# Altium project 2008_SablierElectronique.PrjPcb
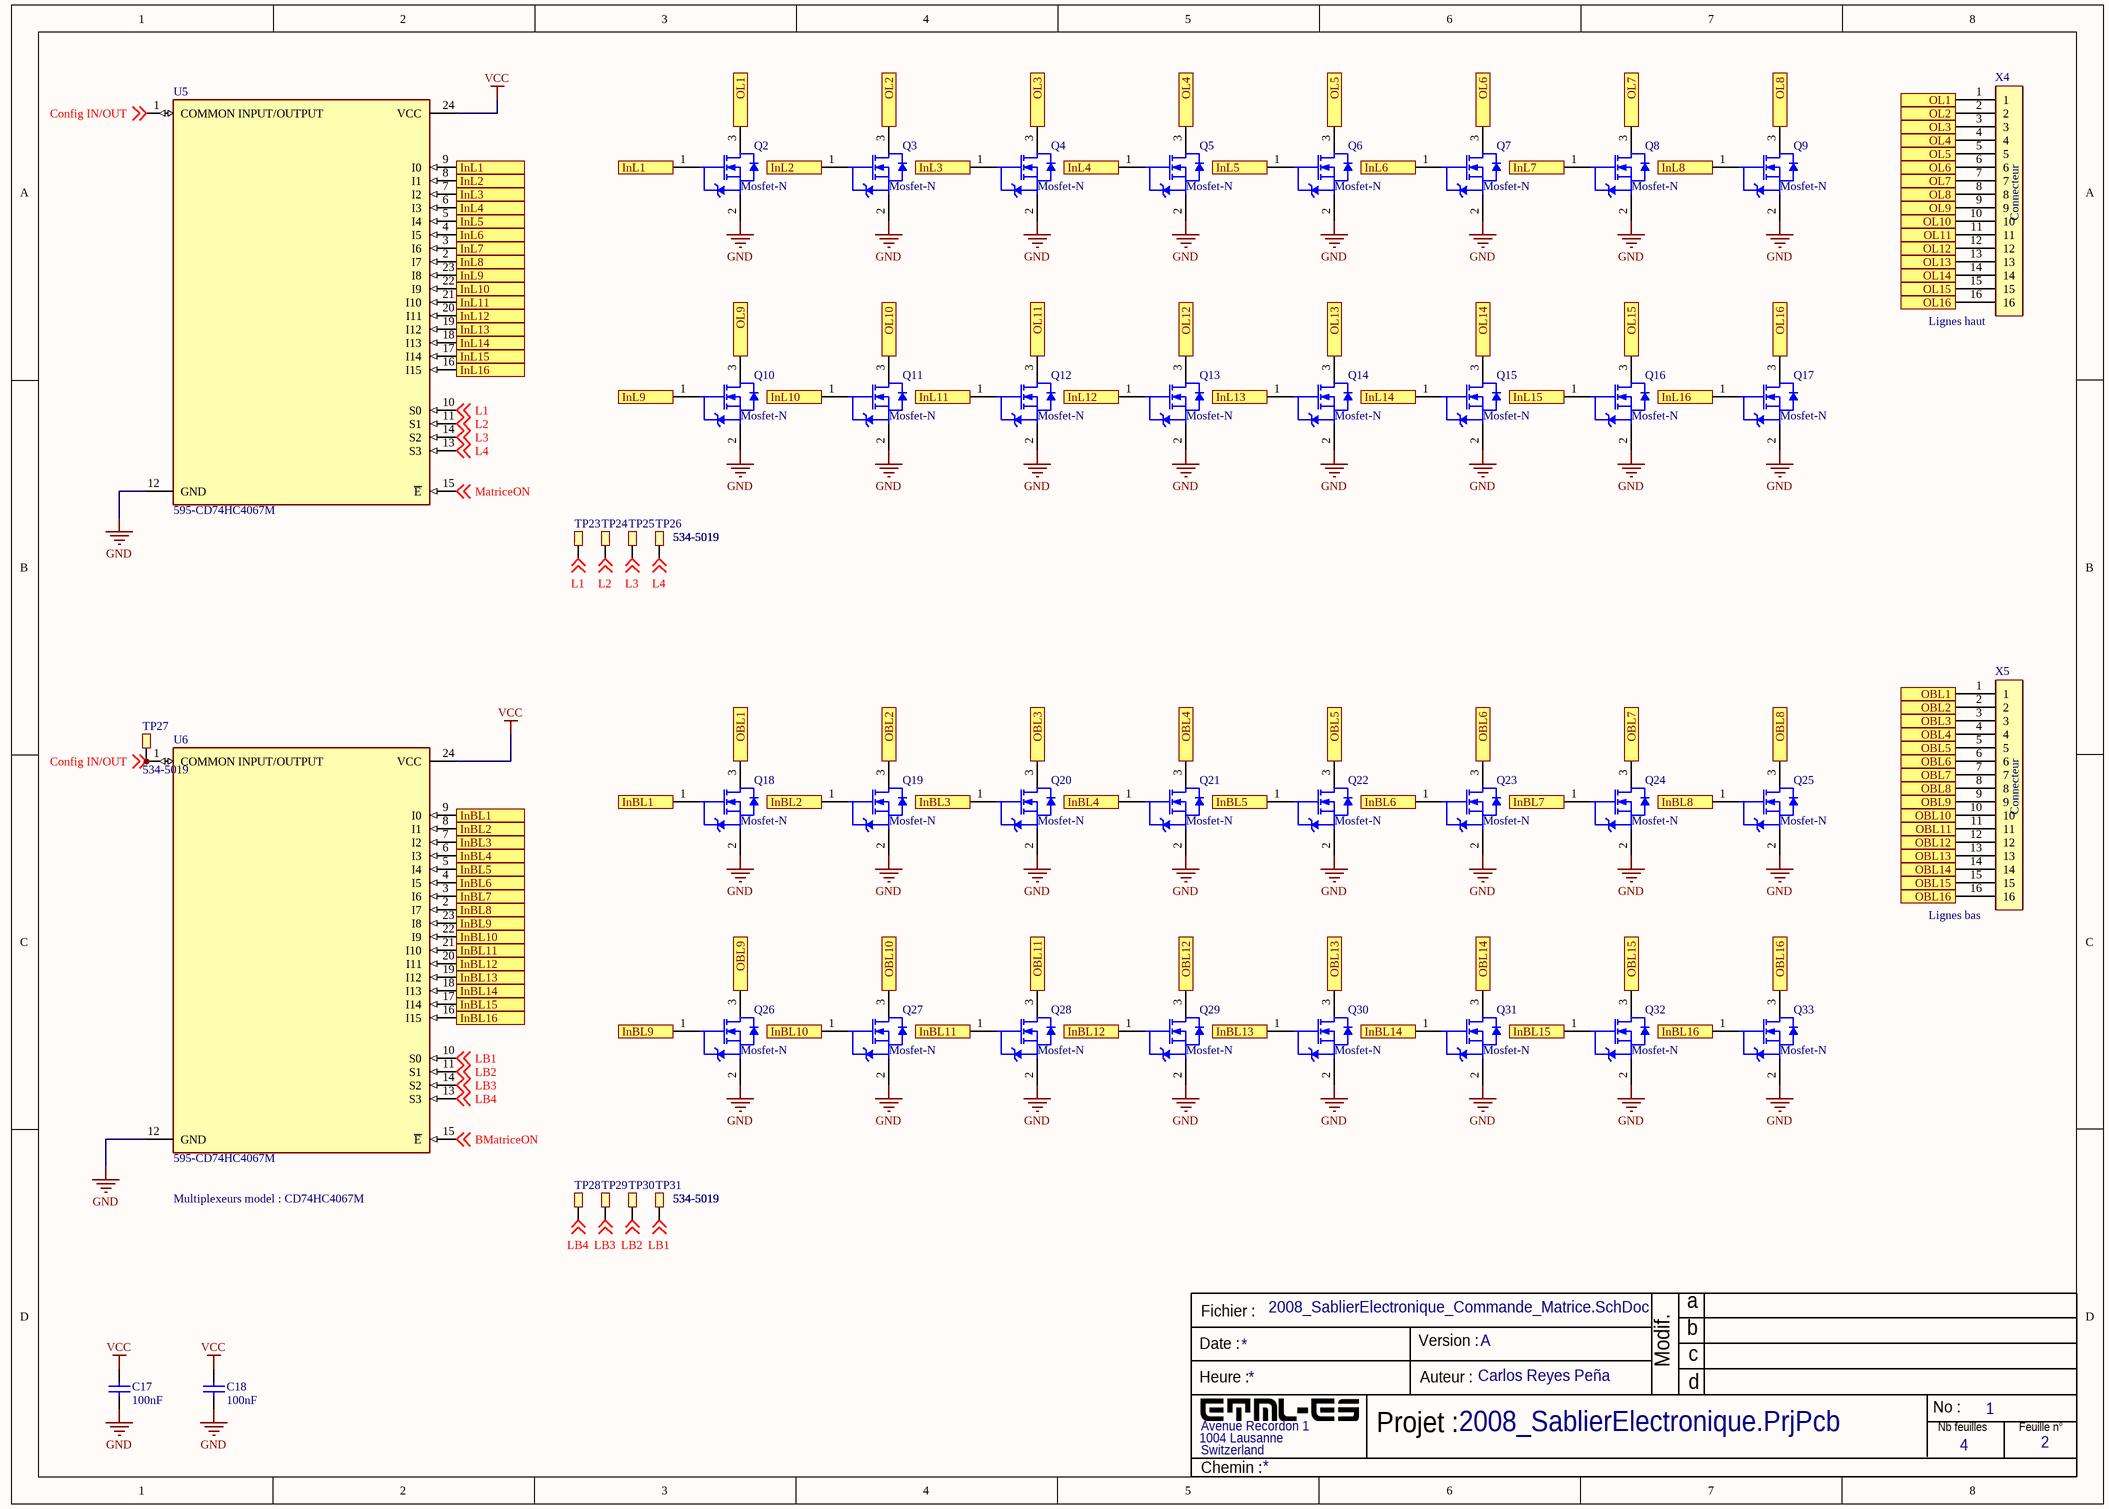
[diagram p0: 2008_SablierElectronique_Commande_Matrice.SchDoc]
3 sheets, 173 parts. Net scope: flat (ports and power ports of the same name join across sheets).
Board file: 2008_SablierElectronique_PCB.PcbDoc
Sheets:
  2008_SablierElectronique_Commande_Matrice.SchDoc
  2008_SablierElectronique_MosfetConnections.SchDoc
  2008_SablierElectronique_SCH.SchDoc

## Sheet 2008_SablierElectronique_Commande_Matrice.SchDoc
size A3; Author: Carlos Reyes Peña; Organization: ETML-ES; Address1: Avenue Recordon 1; Address2: 1004 Lausanne; Address3: Switzerland; Revision: 1; SheetNumber: 2; SheetTotal: 4; Version: A

### Parts
C17  100nF  [RESC0805(2012)_L]
C18  100nF  [RESC0805(2012)_L]
Q2  Mosfet-N  [FAIR-SOT23-3_V]
Q3  Mosfet-N  [FAIR-SOT23-3_V]
Q4  Mosfet-N  [FAIR-SOT23-3_V]
Q5  Mosfet-N  [FAIR-SOT23-3_V]
Q6  Mosfet-N  [FAIR-SOT23-3_V]
Q7  Mosfet-N  [FAIR-SOT23-3_V]
Q8  Mosfet-N  [FAIR-SOT23-3_V]
Q9  Mosfet-N  [FAIR-SOT23-3_V]
Q10  Mosfet-N  [FAIR-SOT23-3_V]
Q11  Mosfet-N  [FAIR-SOT23-3_V]
Q12  Mosfet-N  [FAIR-SOT23-3_V]
Q13  Mosfet-N  [FAIR-SOT23-3_V]
Q14  Mosfet-N  [FAIR-SOT23-3_V]
Q15  Mosfet-N  [FAIR-SOT23-3_V]
Q16  Mosfet-N  [FAIR-SOT23-3_V]
Q17  Mosfet-N  [FAIR-SOT23-3_V]
Q18  Mosfet-N  [FAIR-SOT23-3_V]
Q19  Mosfet-N  [FAIR-SOT23-3_V]
Q20  Mosfet-N  [FAIR-SOT23-3_V]
Q21  Mosfet-N  [FAIR-SOT23-3_V]
Q22  Mosfet-N  [FAIR-SOT23-3_V]
Q23  Mosfet-N  [FAIR-SOT23-3_V]
Q24  Mosfet-N  [FAIR-SOT23-3_V]
Q25  Mosfet-N  [FAIR-SOT23-3_V]
Q26  Mosfet-N  [FAIR-SOT23-3_V]
Q27  Mosfet-N  [FAIR-SOT23-3_V]
Q28  Mosfet-N  [FAIR-SOT23-3_V]
Q29  Mosfet-N  [FAIR-SOT23-3_V]
Q30  Mosfet-N  [FAIR-SOT23-3_V]
Q31  Mosfet-N  [FAIR-SOT23-3_V]
Q32  Mosfet-N  [FAIR-SOT23-3_V]
Q33  Mosfet-N  [FAIR-SOT23-3_V]
TP23  Supplier Part Number 1: 534-5019  [TESTPOINT_SMD]  (hidden comment: 5019)
TP24  Supplier Part Number 1: 534-5019  [TESTPOINT_SMD]  (hidden comment: 5019)
TP25  Supplier Part Number 1: 534-5019  [TESTPOINT_SMD]  (hidden comment: 5019)
TP26  Supplier Part Number 1: 534-5019  [TESTPOINT_SMD]  (hidden comment: 5019)
TP27  Supplier Part Number 1: 534-5019  [TESTPOINT_SMD]  (hidden comment: 5019)
TP28  Supplier Part Number 1: 534-5019  [TESTPOINT_SMD]  (hidden comment: 5019)
TP29  Supplier Part Number 1: 534-5019  [TESTPOINT_SMD]  (hidden comment: 5019)
TP30  Supplier Part Number 1: 534-5019  [TESTPOINT_SMD]  (hidden comment: 5019)
TP31  Supplier Part Number 1: 534-5019  [TESTPOINT_SMD]  (hidden comment: 5019)
U5  Supplier Part Number 1: 595-CD74HC4067M  [SOIC24]  (hidden comment: CD74HCT4067)
U6  Supplier Part Number 1: 595-CD74HC4067M  [SOIC24]  (hidden comment: CD74HCT4067)
X4  Lignes haut  [CON8x8(edited)]
X5  Lignes bas  [CON8x8(edited)]

### Ports
InBL1 (in), InBL1 (out), InBL2 (in), InBL2 (out), InBL3 (in), InBL3 (out), InBL4 (in), InBL4 (out), InBL5 (in), InBL5 (out), InBL6 (in), InBL6 (out), InBL7 (in), InBL7 (out), InBL8 (in), InBL8 (out), InBL9 (in), InBL9 (out), InBL10 (in), InBL10 (out), InBL11 (in), InBL11 (out), InBL12 (in), InBL12 (out), InBL13 (in), InBL13 (out), InBL14 (in), InBL14 (out), InBL15 (in), InBL15 (out), InBL16 (in), InBL16 (out), InL1 (in), InL1 (out), InL2 (in), InL2 (out), InL3 (in), InL3 (out), InL4 (in), InL4 (out), InL5 (in), InL5 (out), InL6 (in), InL6 (out), InL7 (in), InL7 (out), InL8 (in), InL8 (out), InL9 (in), InL9 (out), InL10 (in), InL10 (out), InL11 (in), InL11 (out), InL12 (in), InL12 (out), InL13 (in), InL13 (out), InL14 (in), InL14 (out), InL15 (in), InL15 (out), InL16 (in), InL16 (out), OBL1 (in), OBL1 (out), OBL2 (in), OBL2 (out), OBL3 (in), OBL3 (out), OBL4 (in), OBL4 (out), OBL5 (in), OBL5 (out), OBL6 (in), OBL6 (out), OBL7 (in), OBL7 (out), OBL8 (in), OBL8 (out), OBL9 (in), OBL9 (out), OBL10 (in), OBL10 (out), OBL11 (in), OBL11 (out), OBL12 (in), OBL12 (out), OBL13 (in), OBL13 (out), OBL14 (in), OBL14 (out), OBL15 (in), OBL15 (out), OBL16 (in), OBL16 (out), OL1 (in), OL1 (out), OL2 (in), OL2 (out), OL3 (in), OL3 (out), OL4 (in), OL4 (out), OL5 (in), OL5 (out), OL6 (in), OL6 (out), OL7 (in), OL7 (out), OL8 (in), OL8 (out), OL9 (in), OL9 (out), OL10 (in), OL10 (out), OL11 (in), OL11 (out), OL12 (in), OL12 (out), OL13 (in), OL13 (out), OL14 (in), OL14 (out), OL15 (in), OL15 (out), OL16 (in), OL16 (out)

### Nets
GND: C17.1 C18.1 Q2.2(S) Q3.2(S) Q4.2(S) Q5.2(S) Q6.2(S) Q7.2(S) Q8.2(S) Q9.2(S) Q10.2(S) Q11.2(S) Q12.2(S) Q13.2(S) Q14.2(S) Q15.2(S) Q16.2(S) Q17.2(S) Q18.2(S) Q19.2(S) Q20.2(S) Q21.2(S) Q22.2(S) Q23.2(S) Q24.2(S) Q25.2(S) Q26.2(S) Q27.2(S) Q28.2(S) Q29.2(S) Q30.2(S) Q31.2(S) Q32.2(S) Q33.2(S) U5.12(GND) U6.12(GND)
VCC: C17.2 C18.2 U5.24(VCC) U6.24(VCC)
BMatriceON: U6.15(~{E}) ; off-sheet BMatriceON
Config IN/OUT: TP27.1 U5.1(COMMON_INPUT/OUTPUT) U6.1(COMMON_INPUT/OUTPUT) ; off-sheet Config IN/OUT
L1: TP23.1 U5.10(S0) ; off-sheet L1
L2: TP24.1 U5.11(S1) ; off-sheet L2
L3: TP25.1 U5.14(S2) ; off-sheet L3
L4: TP26.1 U5.13(S3) ; off-sheet L4
LB1: TP31.1 U6.10(S0) ; off-sheet LB1
LB2: TP30.1 U6.11(S1) ; off-sheet LB2
LB3: TP29.1 U6.14(S2) ; off-sheet LB3
LB4: TP28.1 U6.13(S3) ; off-sheet LB4
MatriceON: U5.15(~{E}) ; off-sheet MatriceON
NetQ2_1: Q2.1(G) U5.9(I0) ; port InL1
NetQ2_3: Q2.3(D) X4.1 ; port OL1
NetQ3_1: Q3.1(G) U5.8(I1) ; port InL2
NetQ3_3: Q3.3(D) X4.2 ; port OL2
NetQ4_1: Q4.1(G) U5.7(I2) ; port InL3
NetQ4_3: Q4.3(D) X4.3 ; port OL3
NetQ5_1: Q5.1(G) U5.6(I3) ; port InL4
NetQ5_3: Q5.3(D) X4.4 ; port OL4
NetQ6_1: Q6.1(G) U5.5(I4) ; port InL5
NetQ6_3: Q6.3(D) X4.5 ; port OL5
NetQ7_1: Q7.1(G) U5.4(I5) ; port InL6
NetQ7_3: Q7.3(D) X4.6 ; port OL6
NetQ8_1: Q8.1(G) U5.3(I6) ; port InL7
NetQ8_3: Q8.3(D) X4.7 ; port OL7
NetQ9_1: Q9.1(G) U5.2(I7) ; port InL8
NetQ9_3: Q9.3(D) X4.8 ; port OL8
NetQ10_1: Q10.1(G) U5.23(I8) ; port InL9
NetQ10_3: Q10.3(D) X4.9 ; port OL9
NetQ11_1: Q11.1(G) U5.22(I9) ; port InL10
NetQ11_3: Q11.3(D) X4.10 ; port OL10
NetQ12_1: Q12.1(G) U5.21(I10) ; port InL11
NetQ12_3: Q12.3(D) X4.11 ; port OL11
NetQ13_1: Q13.1(G) U5.20(I11) ; port InL12
NetQ13_3: Q13.3(D) X4.12 ; port OL12
NetQ14_1: Q14.1(G) U5.19(I12) ; port InL13
NetQ14_3: Q14.3(D) X4.13 ; port OL13
NetQ15_1: Q15.1(G) U5.18(I13) ; port InL14
NetQ15_3: Q15.3(D) X4.14 ; port OL14
NetQ16_1: Q16.1(G) U5.17(I14) ; port InL15
NetQ16_3: Q16.3(D) X4.15 ; port OL15
NetQ17_1: Q17.1(G) U5.16(I15) ; port InL16
NetQ17_3: Q17.3(D) X4.16 ; port OL16
NetQ18_1: Q18.1(G) U6.9(I0) ; port InBL1
NetQ18_3: Q18.3(D) X5.1 ; port OBL1
NetQ19_1: Q19.1(G) U6.8(I1) ; port InBL2
NetQ19_3: Q19.3(D) X5.2 ; port OBL2
NetQ20_1: Q20.1(G) U6.7(I2) ; port InBL3
NetQ20_3: Q20.3(D) X5.3 ; port OBL3
NetQ21_1: Q21.1(G) U6.6(I3) ; port InBL4
NetQ21_3: Q21.3(D) X5.4 ; port OBL4
NetQ22_1: Q22.1(G) U6.5(I4) ; port InBL5
NetQ22_3: Q22.3(D) X5.5 ; port OBL5
NetQ23_1: Q23.1(G) U6.4(I5) ; port InBL6
NetQ23_3: Q23.3(D) X5.6 ; port OBL6
NetQ24_1: Q24.1(G) U6.3(I6) ; port InBL7
NetQ24_3: Q24.3(D) X5.7 ; port OBL7
NetQ25_1: Q25.1(G) U6.2(I7) ; port InBL8
NetQ25_3: Q25.3(D) X5.8 ; port OBL8
NetQ26_1: Q26.1(G) U6.23(I8) ; port InBL9
NetQ26_3: Q26.3(D) X5.9 ; port OBL9
NetQ27_1: Q27.1(G) U6.22(I9) ; port InBL10
NetQ27_3: Q27.3(D) X5.10 ; port OBL10
NetQ28_1: Q28.1(G) U6.21(I10) ; port InBL11
NetQ28_3: Q28.3(D) X5.11 ; port OBL11
NetQ29_1: Q29.1(G) U6.20(I11) ; port InBL12
NetQ29_3: Q29.3(D) X5.12 ; port OBL12
NetQ30_1: Q30.1(G) U6.19(I12) ; port InBL13
NetQ30_3: Q30.3(D) X5.13 ; port OBL13
NetQ31_1: Q31.1(G) U6.18(I13) ; port InBL14
NetQ31_3: Q31.3(D) X5.14 ; port OBL14
NetQ32_1: Q32.1(G) U6.17(I14) ; port InBL15
NetQ32_3: Q32.3(D) X5.15 ; port OBL15
NetQ33_1: Q33.1(G) U6.16(I15) ; port InBL16
NetQ33_3: Q33.3(D) X5.16 ; port OBL16

### Notes on the sheet
- Multiplexeurs model : CD74HC4067M
- Fichier :
- a
- Date :
- Heure :
- Version :
- Auteur :
- Modif.
- b
- c
- d
- Projet :
- No :
- Nb feuilles
- Feuille n°
- Chemin :
- (in symbol Mâle DIN 8 x 8) Connecteur

### Library data of the parts
C17 C18 = CAP1206
Q2-Q33 = NEMOS-GSD-3_D
TP23-TP31 = TESTPOINT: Test point smd; Supplier 1: Mouser
X4 X5 = Mâle DIN 8 x 8
U5 U6 = CD74HCT4067: Supplier 1: Mouser

## Sheet 2008_SablierElectronique_MosfetConnections.SchDoc
size A3; Author: Carlos Reyes Peña; Organization: ETML-ES; Address1: Avenue Recordon 1; Address2: 1004 Lausanne; Address3: Switzerland; Revision: 1; SheetNumber: 3; SheetTotal: 4; Version: A
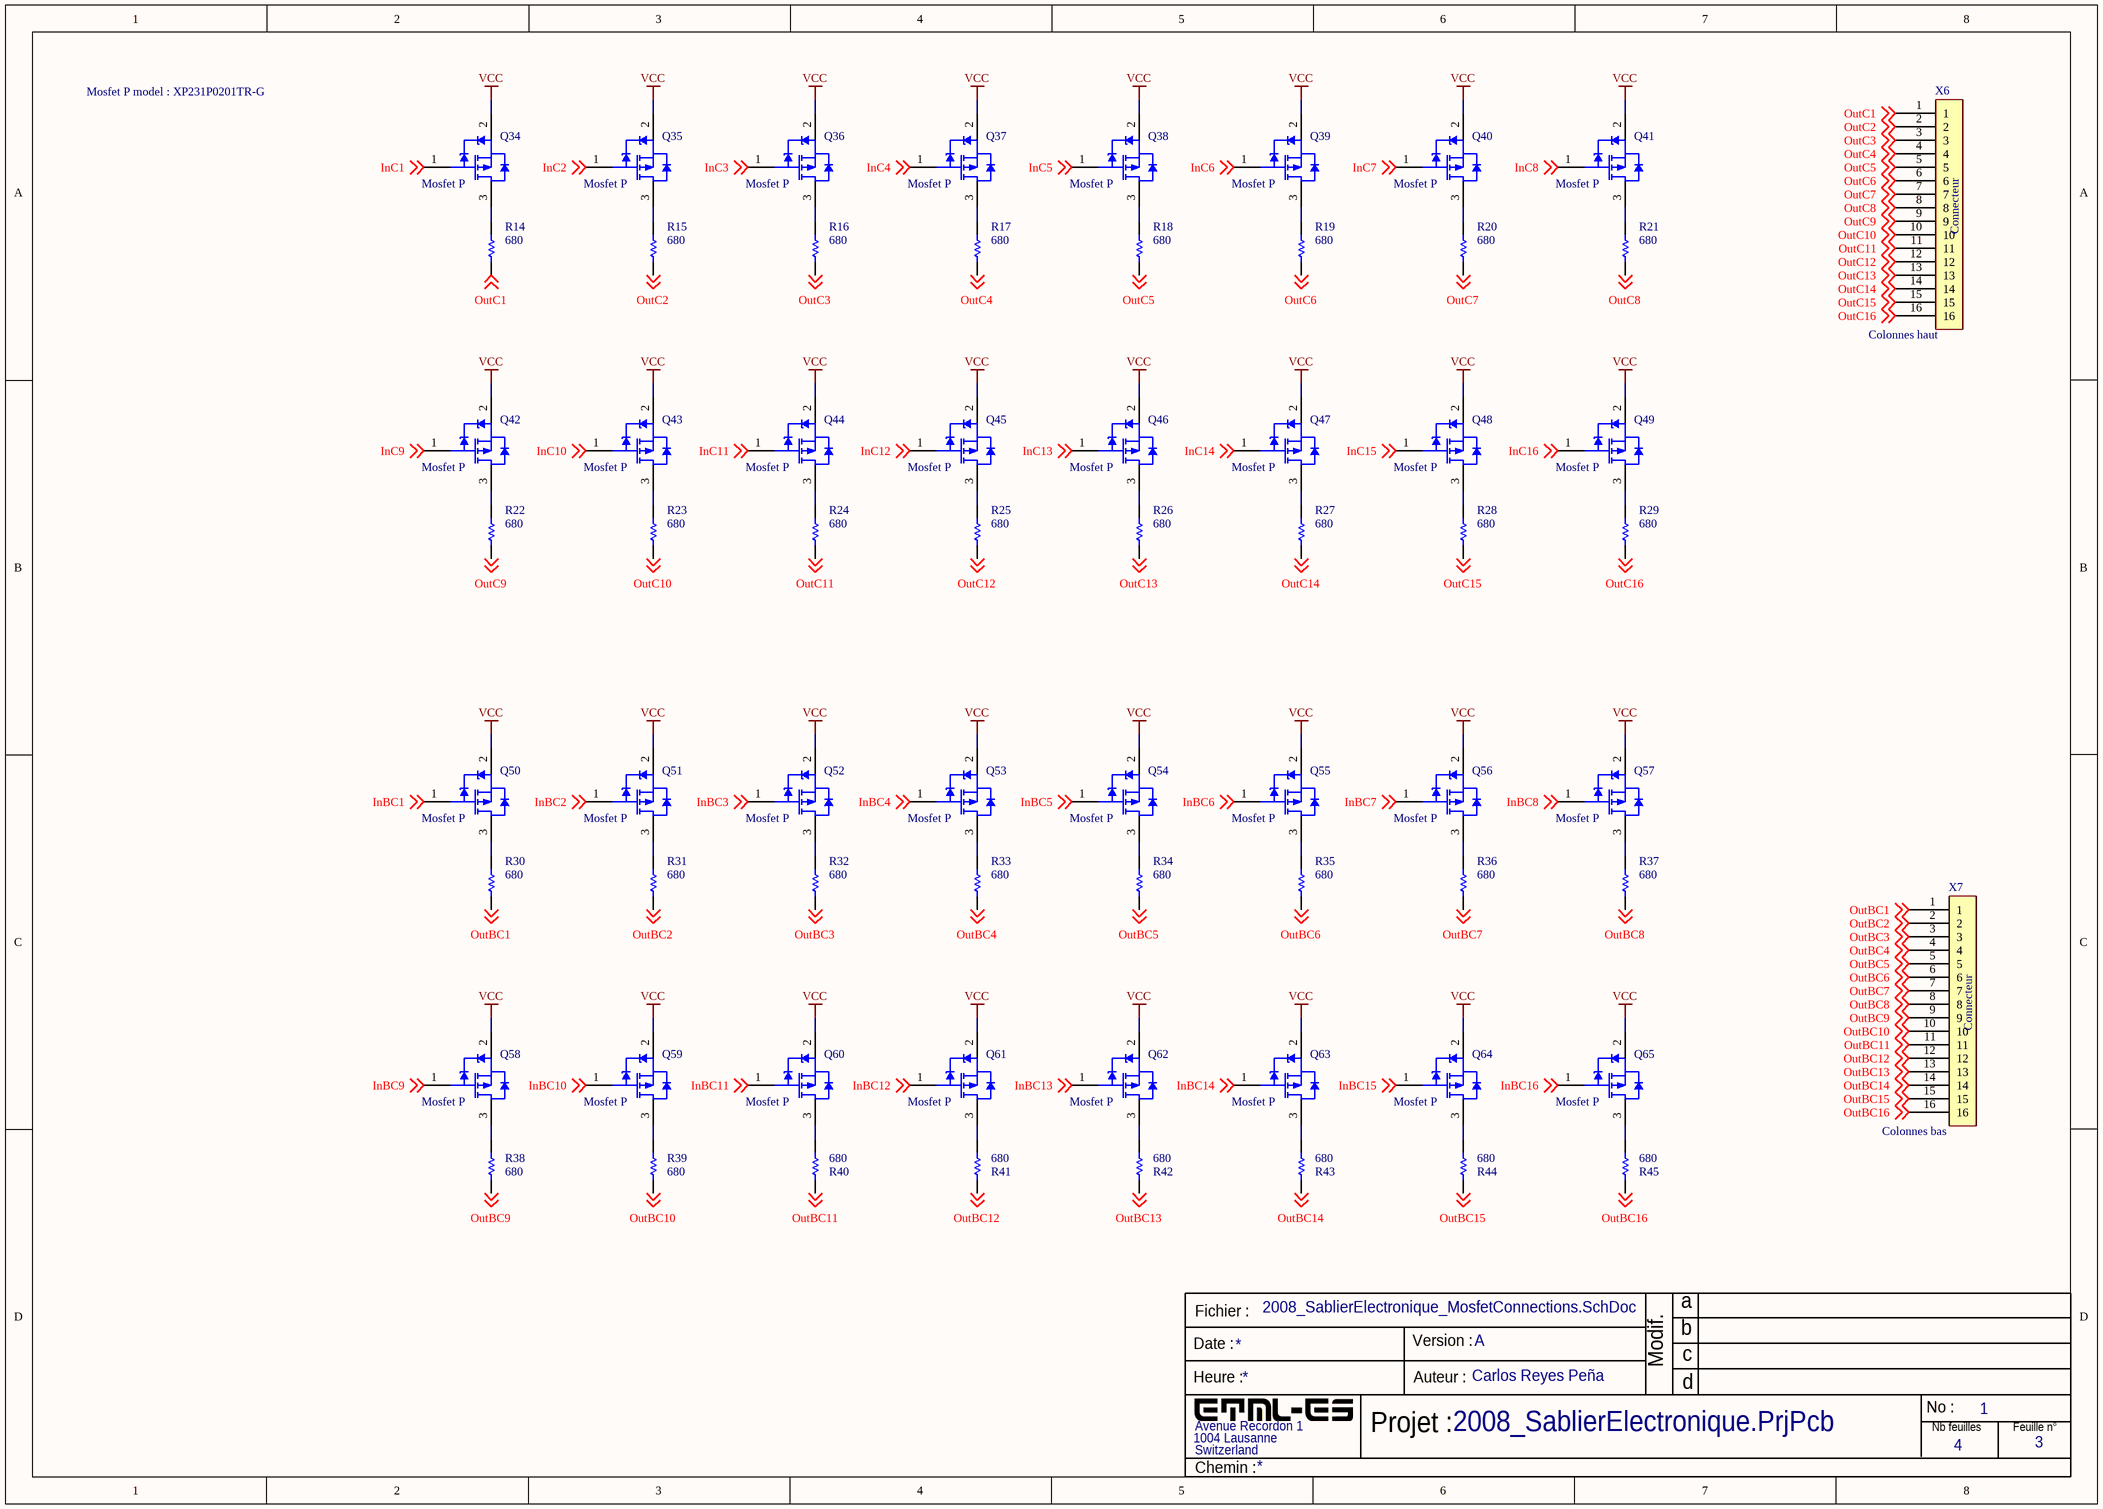
[diagram p1: 2008_SablierElectronique_MosfetConnections.SchDoc]

### Parts
Q34  Mosfet P  [FAIR-SOT23-3_V]
Q35  Mosfet P  [FAIR-SOT23-3_V]
Q36  Mosfet P  [FAIR-SOT23-3_V]
Q37  Mosfet P  [FAIR-SOT23-3_V]
Q38  Mosfet P  [FAIR-SOT23-3_V]
Q39  Mosfet P  [FAIR-SOT23-3_V]
Q40  Mosfet P  [FAIR-SOT23-3_V]
Q41  Mosfet P  [FAIR-SOT23-3_V]
Q42  Mosfet P  [FAIR-SOT23-3_V]
Q43  Mosfet P  [FAIR-SOT23-3_V]
Q44  Mosfet P  [FAIR-SOT23-3_V]
Q45  Mosfet P  [FAIR-SOT23-3_V]
Q46  Mosfet P  [FAIR-SOT23-3_V]
Q47  Mosfet P  [FAIR-SOT23-3_V]
Q48  Mosfet P  [FAIR-SOT23-3_V]
Q49  Mosfet P  [FAIR-SOT23-3_V]
Q50  Mosfet P  [FAIR-SOT23-3_V]
Q51  Mosfet P  [FAIR-SOT23-3_V]
Q52  Mosfet P  [FAIR-SOT23-3_V]
Q53  Mosfet P  [FAIR-SOT23-3_V]
Q54  Mosfet P  [FAIR-SOT23-3_V]
Q55  Mosfet P  [FAIR-SOT23-3_V]
Q56  Mosfet P  [FAIR-SOT23-3_V]
Q57  Mosfet P  [FAIR-SOT23-3_V]
Q58  Mosfet P  [FAIR-SOT23-3_V]
Q59  Mosfet P  [FAIR-SOT23-3_V]
Q60  Mosfet P  [FAIR-SOT23-3_V]
Q61  Mosfet P  [FAIR-SOT23-3_V]
Q62  Mosfet P  [FAIR-SOT23-3_V]
Q63  Mosfet P  [FAIR-SOT23-3_V]
Q64  Mosfet P  [FAIR-SOT23-3_V]
Q65  Mosfet P  [FAIR-SOT23-3_V]
R14  680  [RESC0805(2012)_L]
R15  680  [RESC0805(2012)_L]
R16  680  [RESC0805(2012)_L]
R17  680  [RESC0805(2012)_L]
R18  680  [RESC0805(2012)_L]
R19  680  [RESC0805(2012)_L]
R20  680  [RESC0805(2012)_L]
R21  680  [RESC0805(2012)_L]
R22  680  [RESC0805(2012)_L]
R23  680  [RESC0805(2012)_L]
R24  680  [RESC0805(2012)_L]
R25  680  [RESC0805(2012)_L]
R26  680  [RESC0805(2012)_L]
R27  680  [RESC0805(2012)_L]
R28  680  [RESC0805(2012)_L]
R29  680  [RESC0805(2012)_L]
R30  680  [RESC0805(2012)_L]
R31  680  [RESC0805(2012)_L]
R32  680  [RESC0805(2012)_L]
R33  680  [RESC0805(2012)_L]
R34  680  [RESC0805(2012)_L]
R35  680  [RESC0805(2012)_L]
R36  680  [RESC0805(2012)_L]
R37  680  [RESC0805(2012)_L]
R38  680  [RESC0805(2012)_L]
R39  680  [RESC0805(2012)_L]
R40  680  [RESC0805(2012)_L]
R41  680  [RESC0805(2012)_L]
R42  680  [RESC0805(2012)_L]
R43  680  [RESC0805(2012)_L]
R44  680  [RESC0805(2012)_L]
R45  680  [RESC0805(2012)_L]
X6  Colonnes haut  [CON8x8(edited)]
X7  Colonnes bas  [CON8x8(edited)]

### Nets
VCC: Q34.2(S) Q35.2(S) Q36.2(S) Q37.2(S) Q38.2(S) Q39.2(S) Q40.2(S) Q41.2(S) Q42.2(S) Q43.2(S) Q44.2(S) Q45.2(S) Q46.2(S) Q47.2(S) Q48.2(S) Q49.2(S) Q50.2(S) Q51.2(S) Q52.2(S) Q53.2(S) Q54.2(S) Q55.2(S) Q56.2(S) Q57.2(S) Q58.2(S) Q59.2(S) Q60.2(S) Q61.2(S) Q62.2(S) Q63.2(S) Q64.2(S) Q65.2(S)
InBC1: Q50.1(G) ; off-sheet InBC1
InBC2: Q51.1(G) ; off-sheet InBC2
InBC3: Q52.1(G) ; off-sheet InBC3
InBC4: Q53.1(G) ; off-sheet InBC4
InBC5: Q54.1(G) ; off-sheet InBC5
InBC6: Q55.1(G) ; off-sheet InBC6
InBC7: Q56.1(G) ; off-sheet InBC7
InBC8: Q57.1(G) ; off-sheet InBC8
InBC9: Q58.1(G) ; off-sheet InBC9
InBC10: Q59.1(G) ; off-sheet InBC10
InBC11: Q60.1(G) ; off-sheet InBC11
InBC12: Q61.1(G) ; off-sheet InBC12
InBC13: Q62.1(G) ; off-sheet InBC13
InBC14: Q63.1(G) ; off-sheet InBC14
InBC15: Q64.1(G) ; off-sheet InBC15
InBC16: Q65.1(G) ; off-sheet InBC16
InC1: Q34.1(G) ; off-sheet InC1
InC2: Q35.1(G) ; off-sheet InC2
InC3: Q36.1(G) ; off-sheet InC3
InC4: Q37.1(G) ; off-sheet InC4
InC5: Q38.1(G) ; off-sheet InC5
InC6: Q39.1(G) ; off-sheet InC6
InC7: Q40.1(G) ; off-sheet InC7
InC8: Q41.1(G) ; off-sheet InC8
InC9: Q42.1(G) ; off-sheet InC9
InC10: Q43.1(G) ; off-sheet InC10
InC11: Q44.1(G) ; off-sheet InC11
InC12: Q45.1(G) ; off-sheet InC12
InC13: Q46.1(G) ; off-sheet InC13
InC14: Q47.1(G) ; off-sheet InC14
InC15: Q48.1(G) ; off-sheet InC15
InC16: Q49.1(G) ; off-sheet InC16
OutBC1: R30.1 X7.1 ; off-sheet OutBC1
OutBC2: R31.1 X7.2 ; off-sheet OutBC2
OutBC3: R32.1 X7.3 ; off-sheet OutBC3
OutBC4: R33.1 X7.4 ; off-sheet OutBC4
OutBC5: R34.1 X7.5 ; off-sheet OutBC5
OutBC6: R35.1 X7.6 ; off-sheet OutBC6
OutBC7: R36.1 X7.7 ; off-sheet OutBC7
OutBC8: R37.1 X7.8 ; off-sheet OutBC8
OutBC9: R38.1 X7.9 ; off-sheet OutBC9
OutBC10: R39.1 X7.10 ; off-sheet OutBC10
OutBC11: R40.1 X7.11 ; off-sheet OutBC11
OutBC12: R41.1 X7.12 ; off-sheet OutBC12
OutBC13: R42.1 X7.13 ; off-sheet OutBC13
OutBC14: R43.1 X7.14 ; off-sheet OutBC14
OutBC15: R44.1 X7.15 ; off-sheet OutBC15
OutBC16: R45.1 X7.16 ; off-sheet OutBC16
OutC1: R14.1 X6.1 ; off-sheet OutC1
OutC2: R15.1 X6.2 ; off-sheet OutC2
OutC3: R16.1 X6.3 ; off-sheet OutC3
OutC4: R17.1 X6.4 ; off-sheet OutC4
OutC5: R18.1 X6.5 ; off-sheet OutC5
OutC6: R19.1 X6.6 ; off-sheet OutC6
OutC7: R20.1 X6.7 ; off-sheet OutC7
OutC8: R21.1 X6.8 ; off-sheet OutC8
OutC9: R22.1 X6.9 ; off-sheet OutC9
OutC10: R23.1 X6.10 ; off-sheet OutC10
OutC11: R24.1 X6.11 ; off-sheet OutC11
OutC12: R25.1 X6.12 ; off-sheet OutC12
OutC13: R26.1 X6.13 ; off-sheet OutC13
OutC14: R27.1 X6.14 ; off-sheet OutC14
OutC15: R28.1 X6.15 ; off-sheet OutC15
OutC16: R29.1 X6.16 ; off-sheet OutC16
NetQ34_3: Q34.3(D) R14.2
NetQ35_3: Q35.3(D) R15.2
NetQ36_3: Q36.3(D) R16.2
NetQ37_3: Q37.3(D) R17.2
NetQ38_3: Q38.3(D) R18.2
NetQ39_3: Q39.3(D) R19.2
NetQ40_3: Q40.3(D) R20.2
NetQ41_3: Q41.3(D) R21.2
NetQ42_3: Q42.3(D) R22.2
NetQ43_3: Q43.3(D) R23.2
NetQ44_3: Q44.3(D) R24.2
NetQ45_3: Q45.3(D) R25.2
NetQ46_3: Q46.3(D) R26.2
NetQ47_3: Q47.3(D) R27.2
NetQ48_3: Q48.3(D) R28.2
NetQ49_3: Q49.3(D) R29.2
NetQ50_3: Q50.3(D) R30.2
NetQ51_3: Q51.3(D) R31.2
NetQ52_3: Q52.3(D) R32.2
NetQ53_3: Q53.3(D) R33.2
NetQ54_3: Q54.3(D) R34.2
NetQ55_3: Q55.3(D) R35.2
NetQ56_3: Q56.3(D) R36.2
NetQ57_3: Q57.3(D) R37.2
NetQ58_3: Q58.3(D) R38.2
NetQ59_3: Q59.3(D) R39.2
NetQ60_3: Q60.3(D) R40.2
NetQ61_3: Q61.3(D) R41.2
NetQ62_3: Q62.3(D) R42.2
NetQ63_3: Q63.3(D) R43.2
NetQ64_3: Q64.3(D) R44.2
NetQ65_3: Q65.3(D) R45.2

### Notes on the sheet
- Mosfet P model : XP231P0201TR-G
- Fichier :
- a
- Date :
- Heure :
- Version :
- Auteur :
- Modif.
- b
- c
- d
- Projet :
- No :
- Nb feuilles
- Feuille n°
- Chemin :
- (in symbol Mâle DIN 8 x 8) Connecteur

### Library data of the parts
R14-R45 = RES
X6 X7 = Mâle DIN 8 x 8

## Sheet 2008_SablierElectronique_SCH.SchDoc
size A3; Version: A; Author: Carlos  Reyes Peña; Organization: ETML-ES; Address1: Avenue Recordon 1; Address2: 1004 Lausanne; Address3: Switzerland; Revision: 1; SheetNumber: 1; SheetTotal: 4
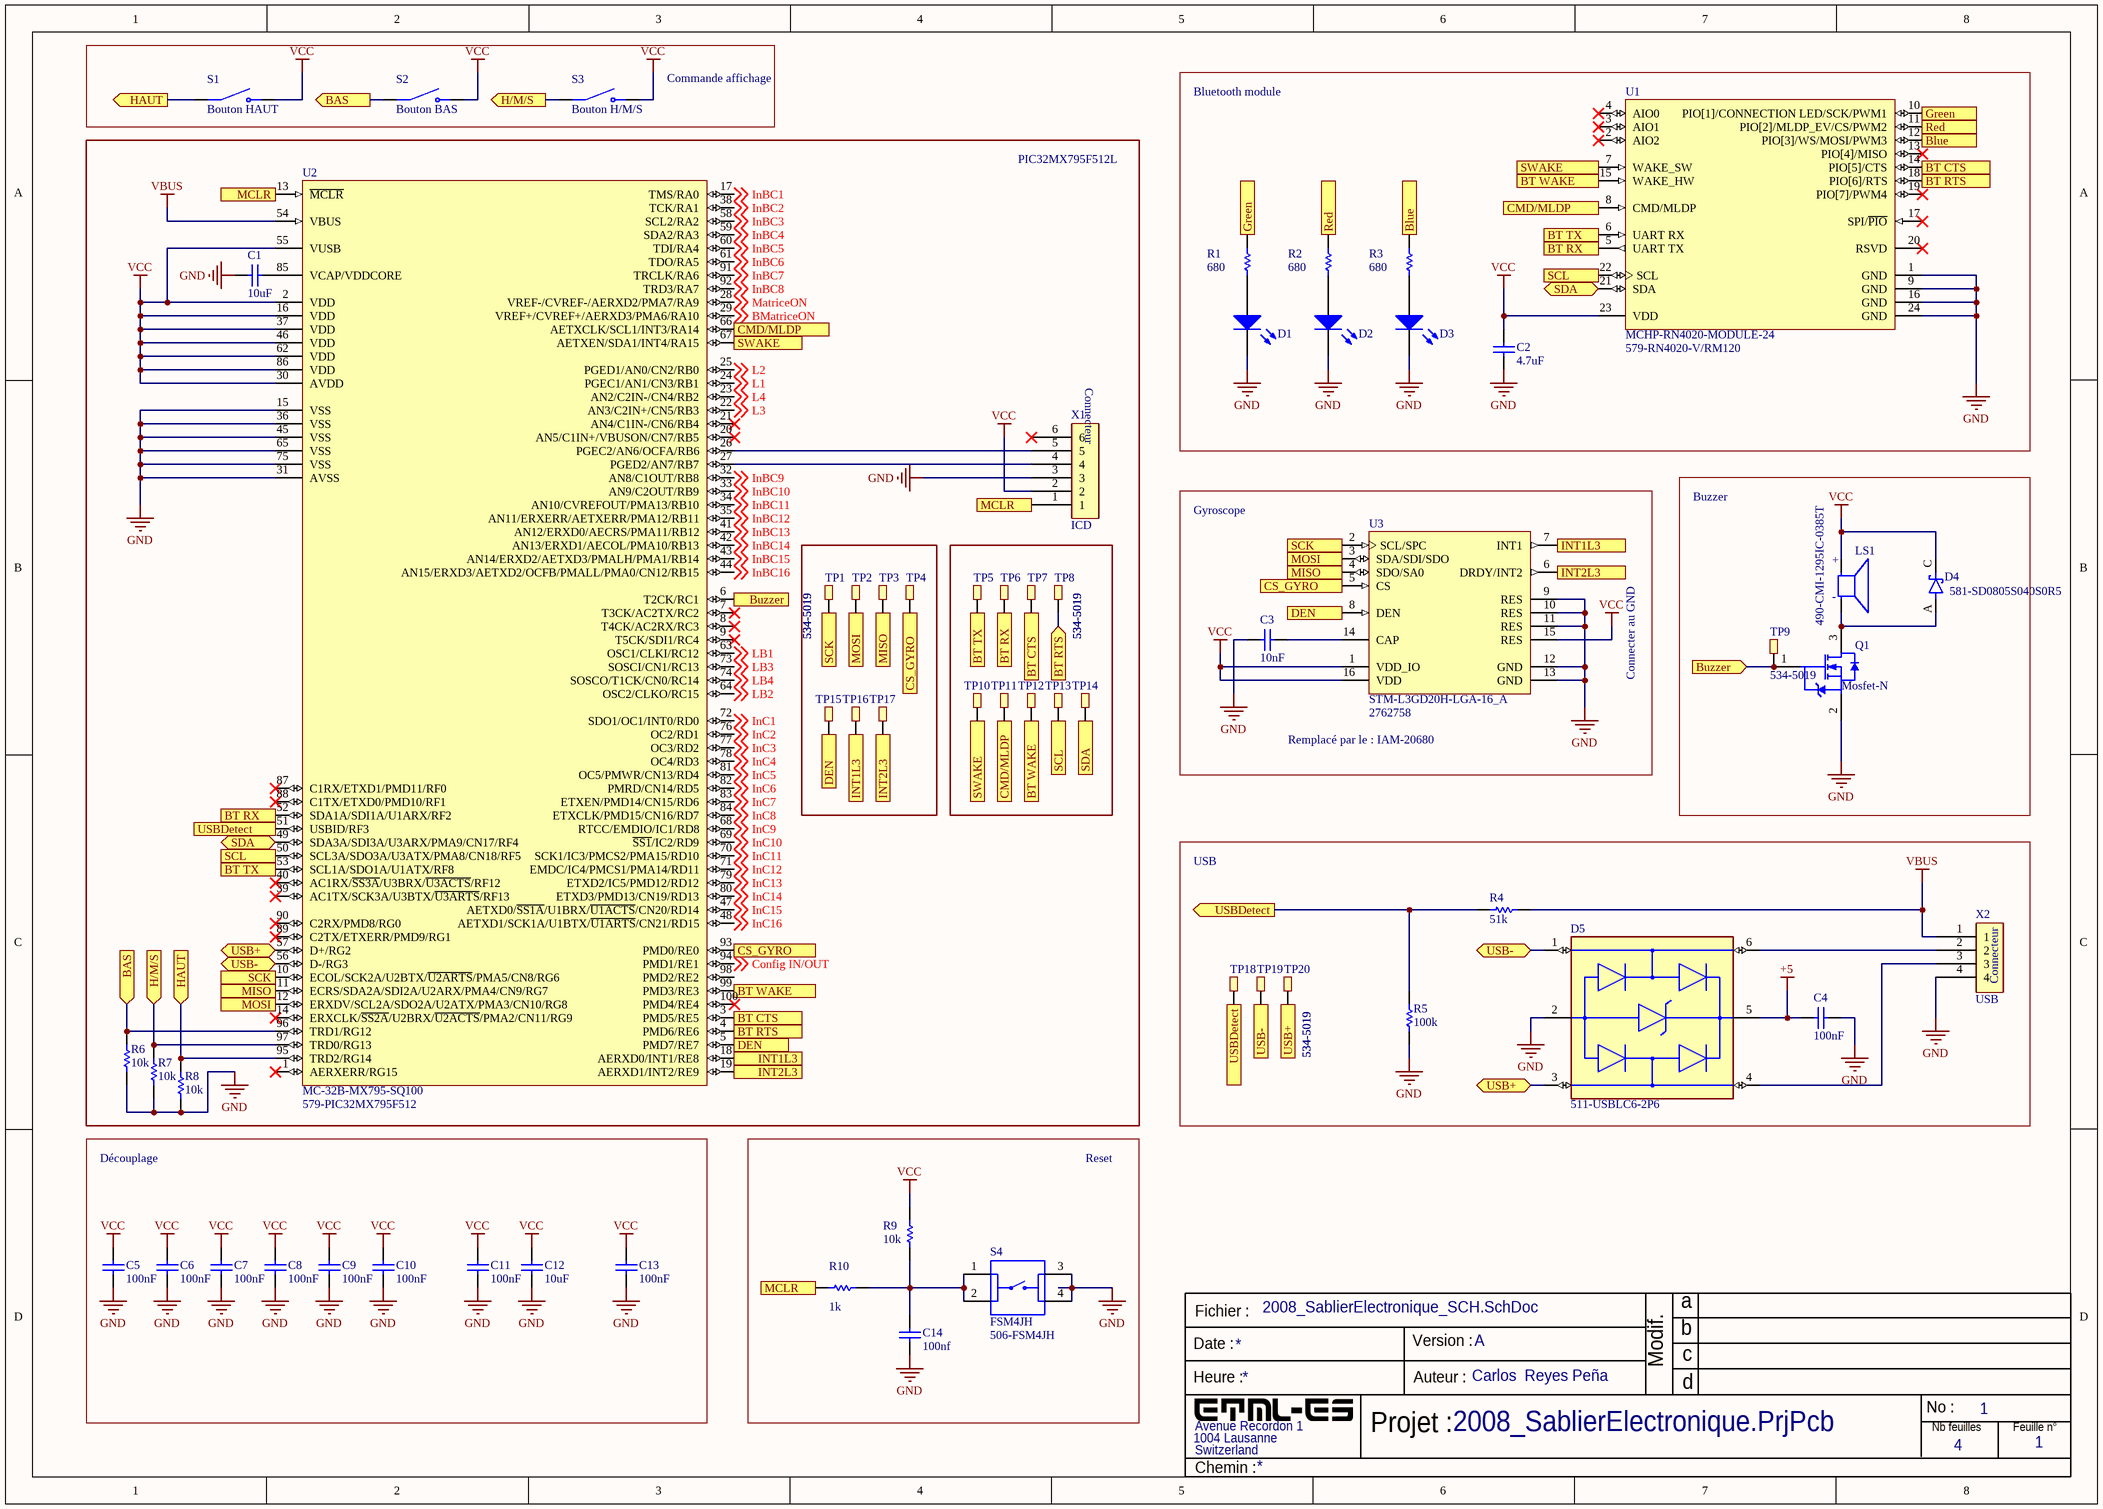
[diagram p2: 2008_SablierElectronique_SCH.SchDoc]

### Parts
C1  10uF  [RESC0805(2012)_L]
C2  4.7uF  [RESC0805(2012)_L]
C3  10nF  [RESC0805(2012)_L]
C4  100nF  [RESC0805(2012)_L]
C5  100nF  [RESC0805(2012)_L]
C6  100nF  [RESC0805(2012)_L]
C7  100nF  [RESC0805(2012)_L]
C8  100nF  [RESC0805(2012)_L]
C9  100nF  [RESC0805(2012)_L]
C10  100nF  [RESC0805(2012)_L]
C11  100nF  [RESC0805(2012)_L]
C12  10uF  [RESC0805(2012)_L]
C13  100nF  [RESC0805(2012)_L]
C14  100nf  [RESC0805(2012)_L]
D1  KPT-2012SRC-PRV  [0805_LED]  (value not drawn)
D2  KPT-2012SRC-PRV  [0805_LED]  (value not drawn)
D3  KPT-2012SRC-PRV  [0805_LED]  (value not drawn)
D4  Supplier Part Number 1: 581-SD0805S040S0R5  [DIOSC130X200X100-2N]  (hidden comment: SD0805S040S0R1)
D5  Supplier Part Number 1: 511-USBLC6-2P6  [FP-SOT-666-MFG]  (hidden comment: USBLC6-2P6)
LS1  Supplier Part Number 1: 490-CMI-1295IC-0385T  [CUI_CMI-1295IC-0385T]  (hidden comment: CMI-1295IC-0385T)
Q1  Mosfet-N  [FAIR-SOT23-3_V]
R1  680  [RESC0805(2012)_L]
R2  680  [RESC0805(2012)_L]
R3  680  [RESC0805(2012)_L]
R4  51k  [RESC0805(2012)_L]
R5  100k  [RESC0805(2012)_L]
R6  10k  [RESC0805(2012)_L]
R7  10k  [RESC0805(2012)_L]
R8  10k  [RESC0805(2012)_L]
R9  10k  [RESC0805(2012)_L]
R10  1k  [RESC0805(2012)_L]
S1  Bouton HAUT  [Header 2 pin]
S2  Bouton BAS  [Header 2 pin]
S3  Bouton H/M/S  [Header 2 pin]
S4  FSM4JH  Supplier Part Number 1: 506-FSM4JH  [SW_FSM4JH]
TP1  Supplier Part Number 1: 534-5019  [TESTPOINT_SMD]  (hidden comment: 5019)
TP2  Supplier Part Number 1: 534-5019  [TESTPOINT_SMD]  (hidden comment: 5019)
TP3  Supplier Part Number 1: 534-5019  [TESTPOINT_SMD]  (hidden comment: 5019)
TP4  Supplier Part Number 1: 534-5019  [TESTPOINT_SMD]  (hidden comment: 5019)
TP5  Supplier Part Number 1: 534-5019  [TESTPOINT_SMD]  (hidden comment: 5019)
TP6  Supplier Part Number 1: 534-5019  [TESTPOINT_SMD]  (hidden comment: 5019)
TP7  Supplier Part Number 1: 534-5019  [TESTPOINT_SMD]  (hidden comment: 5019)
TP8  Supplier Part Number 1: 534-5019  [TESTPOINT_SMD]  (hidden comment: 5019)
TP9  Supplier Part Number 1: 534-5019  [TESTPOINT_SMD]  (hidden comment: 5019)
TP10  5019  [TESTPOINT_SMD_Via]  (value not drawn)
TP11  5019  [TESTPOINT_SMD_Via]  (value not drawn)
TP12  5019  [TESTPOINT_SMD_Via]  (value not drawn)
TP13  5019  [TESTPOINT_SMD_Via]  (value not drawn)
TP14  5019  [TESTPOINT_SMD_Via]  (value not drawn)
TP15  5019  [TESTPOINT_SMD_Via]  (value not drawn)
TP16  5019  [TESTPOINT_SMD_Via]  (value not drawn)
TP17  5019  [TESTPOINT_SMD_Via]  (value not drawn)
TP18  Supplier Part Number 1: 534-5019  [TESTPOINT_SMD]  (hidden comment: 5019)
TP19  Supplier Part Number 1: 534-5019  [TESTPOINT_SMD]  (hidden comment: 5019)
TP20  Supplier Part Number 1: 534-5019  [TESTPOINT_SMD]  (hidden comment: 5019)
U1  MCHP-RN4020-MODULE-24  Supplier Part Number 1: 579-RN4020-V/RM120  [MCHP-MODULE-24_V]
U2  MC-32B-MX795-SQ100  Supplier Part Number 1: 579-PIC32MX795F512  [TQFP-PT100_N]
U3  STM-L3GD20H-LGA-16_A  Supplier Part Number 1: 2762758  [STM-LGA-16]
X1  ICD  [CON6]
X2  USB  [CON4]

### Blocks framed on the sheet
Commande affichage: S1-S3
Bluetooth module: C2 D1-D3 R1-R3 U1
PIC32MX795F512L: C1 R6-R8 TP1-TP8 TP10-TP17 U2 X1
Buzzer: D4 LS1 Q1 TP9
USB: C4 D5 R4 R5 TP18-TP20 X2
Découplage: C5-C13
Reset: C14 R9 R10 S4

### Ports
BAS (in), BAS (out), Blue (in), Blue (out), BT CTS (in), BT CTS (out), BT RTS (in), BT RTS (out), BT RX (in), BT RX (out), BT TX (in), BT TX (out), BT WAKE (in), BT WAKE (out), Buzzer (in), Buzzer (out), CMD/MLDP (in), CMD/MLDP (out), CS_GYRO (in), CS_GYRO (out), DEN (in), DEN (out), Green (in), Green (out), H/M/S (in), H/M/S (out), HAUT (in), HAUT (out), INT1L3 (in), INT1L3 (out), INT2L3 (in), INT2L3 (out), MCLR (in), MCLR (out), MISO (in), MISO (out), MOSI (in), MOSI (out), Red (in), Red (out), SCK (in), SCK (out), SCL (in), SCL (out), SDA (bidir), SDA (in), SWAKE (in), SWAKE (out), USB+ (bidir), USB+ (in), USB- (bidir), USB- (in), USBDetect (in), USBDetect (out)

### Nets
+5: C4.2 D5.5(VBUS)
GND: C1.2 C2.1 C3.1 C4.1 C5.1 C6.1 C7.1 C8.1 C9.1 C10.1 C11.1 C12.1 C13.1 C14.1 D1.1(K) D2.1(K) D3.1(K) D5.2(GND) Q1.2(S) R5.2 R6.2 R7.2 R8.2 S4.3 S4.4 U1.1(GND) U1.9(GND) U1.16(GND) U1.24(GND) U2.15(VSS) U2.31(AVSS) U2.36(VSS) U2.45(VSS) U2.65(VSS) U2.75(VSS) U3.9(RES) U3.10(RES) U3.11(RES) U3.12(GND) U3.13(GND) X1.3 X2.4
VBUS: R4.2 U2.54(VBUS) X2.1
VCC: C2.2 C5.2 C6.2 C7.2 C8.2 C9.2 C10.2 C11.2 C12.2 C13.2 D4.C(K) LS1.P R9.1 S1.2 S2.2 S3.2 U1.23(VDD) U2.2(VDD) U2.16(VDD) U2.30(AVDD) U2.37(VDD) U2.46(VDD) U2.55(VUSB) U2.62(VDD) U2.86(VDD) U3.1(VDD_IO) U3.15(RES) U3.16(VDD) X1.2
BMatriceON: U2.29(VREF+/CVREF+/AERXD3/PMA6/RA10) ; off-sheet BMatriceON
Config IN/OUT: U2.94(PMD1/RE1) ; off-sheet Config IN/OUT
InBC1: U2.17(TMS/RA0) ; off-sheet InBC1
InBC2: U2.38(TCK/RA1) ; off-sheet InBC2
InBC3: U2.58(SCL2/RA2) ; off-sheet InBC3
InBC4: U2.59(SDA2/RA3) ; off-sheet InBC4
InBC5: U2.60(TDI/RA4) ; off-sheet InBC5
InBC6: U2.61(TDO/RA5) ; off-sheet InBC6
InBC7: U2.91(TRCLK/RA6) ; off-sheet InBC7
InBC8: U2.92(TRD3/RA7) ; off-sheet InBC8
InBC9: U2.32(AN8/C1OUT/RB8) ; off-sheet InBC9
InBC10: U2.33(AN9/C2OUT/RB9) ; off-sheet InBC10
InBC11: U2.34(AN10/CVREFOUT/PMA13/RB10) ; off-sheet InBC11
InBC12: U2.35(AN11/ERXERR/AETXERR/PMA12/RB11) ; off-sheet InBC12
InBC13: U2.41(AN12/ERXD0/AECRS/PMA11/RB12) ; off-sheet InBC13
InBC14: U2.42(AN13/ERXD1/AECOL/PMA10/RB13) ; off-sheet InBC14
InBC15: U2.43(AN14/ERXD2/AETXD3/PMALH/PMA1/RB14) ; off-sheet InBC15
InBC16: U2.44(AN15/ERXD3/AETXD2/OCFB/PMALL/PMA0/CN12/RB15) ; off-sheet InBC16
InC1: U2.72(SDO1/OC1/INT0/RD0) ; off-sheet InC1
InC2: U2.76(OC2/RD1) ; off-sheet InC2
InC3: U2.77(OC3/RD2) ; off-sheet InC3
InC4: U2.78(OC4/RD3) ; off-sheet InC4
InC5: U2.81(OC5/PMWR/CN13/RD4) ; off-sheet InC5
InC6: U2.82(PMRD/CN14/RD5) ; off-sheet InC6
InC7: U2.83(ETXEN/PMD14/CN15/RD6) ; off-sheet InC7
InC8: U2.84(ETXCLK/PMD15/CN16/RD7) ; off-sheet InC8
InC9: U2.68(RTCC/EMDIO/IC1/RD8) ; off-sheet InC9
InC10: U2.69(~{SS1}/IC2/RD9) ; off-sheet InC10
InC11: U2.70(SCK1/IC3/PMCS2/PMA15/RD10) ; off-sheet InC11
InC12: U2.71(EMDC/IC4/PMCS1/PMA14/RD11) ; off-sheet InC12
InC13: U2.79(ETXD2/IC5/PMD12/RD12) ; off-sheet InC13
InC14: U2.80(ETXD3/PMD13/CN19/RD13) ; off-sheet InC14
InC15: U2.47(AETXD0/~{SS1A}/U1BRX/~{U1ACTS}/CN20/RD14) ; off-sheet InC15
InC16: U2.48(AETXD1/SCK1A/U1BTX/~{U1ARTS}/CN21/RD15) ; off-sheet InC16
L1: U2.24(PGEC1/AN1/CN3/RB1) ; off-sheet L1
L2: U2.25(PGED1/AN0/CN2/RB0) ; off-sheet L2
L3: U2.22(AN3/C2IN+/CN5/RB3) ; off-sheet L3
L4: U2.23(AN2/C2IN-/CN4/RB2) ; off-sheet L4
LB1: U2.63(OSC1/CLKI/RC12) ; off-sheet LB1
LB2: U2.64(OSC2/CLKO/RC15) ; off-sheet LB2
LB3: U2.73(SOSCI/CN1/RC13) ; off-sheet LB3
LB4: U2.74(SOSCO/T1CK/CN0/RC14) ; off-sheet LB4
MatriceON: U2.28(VREF-/CVREF-/AERXD2/PMA7/RA9) ; off-sheet MatriceON
NetC1_1: C1.1 U2.85(VCAP/VDDCORE)
NetC3_2: C3.2 U3.14(CAP)
NetC14_2: C14.2 R9.2 R10.1 S4.1 S4.2
NetD1_2: D1.2(A) R1.2
NetD2_2: D2.2(A) R2.2
NetD3_2: D3.2(A) R3.2
NetD4_A: D4.A LS1.N Q1.3(D)
NetD5_1: D5.1(I/O1) TP19.1 U2.56(D-/RG3) ; port USB-
NetD5_3: D5.3(I/O2) TP20.1 U2.57(D+/RG2) ; port USB+
NetD5_4: D5.4(I/O2) X2.3
NetD5_6: D5.6(I/O1) X2.2
NetQ1_1: Q1.1(G) TP9.1 U2.6(T2CK/RC1) ; port Buzzer
NetR1_1: R1.1 U1.10(PIO[1]/CONNECTION_LED/SCK/PWM1) ; port Green
NetR2_1: R2.1 U1.11(PIO[2]/MLDP_EV/CS/PWM2) ; port Red
NetR3_1: R3.1 U1.12(PIO[3]/WS/MOSI/PWM3) ; port Blue
NetR4_1: R4.1 R5.1 TP18.1 U2.51(USBID/RF3) ; port USBDetect
NetR6_1: R6.1 S2.1 U2.96(TRD1/RG12) ; port BAS
NetR7_1: R7.1 S3.1 U2.97(TRD0/RG13) ; port H/M/S
NetR8_1: R8.1 S1.1 U2.95(TRD2/RG14) ; port HAUT
NetR10_2: R10.2 U2.13(~{MCLR}) X1.1 ; port MCLR
NetTP1_1: TP1.1 U2.10(ECOL/SCK2A/U2BTX/~{U2ARTS}/PMA5/CN8/RG6) U3.2(SCL/SPC) ; port SCK
NetTP2_1: TP2.1 U2.12(ERXDV/SCL2A/SDO2A/U2ATX/PMA3/CN10/RG8) U3.3(SDA/SDI/SDO) ; port MOSI
NetTP3_1: TP3.1 U2.11(ECRS/SDA2A/SDI2A/U2ARX/PMA4/CN9/RG7) U3.4(SDO/SA0) ; port MISO
NetTP4_1: TP4.1 U2.93(PMD0/RE0) U3.5(CS) ; port CS_GYRO
NetTP5_1: TP5.1 U1.6(UART_RX) U2.53(SCL1A/SDO1A/U1ATX/RF8) ; port BT TX
NetTP6_1: TP6.1 U1.5(UART_TX) U2.52(SDA1A/SDI1A/U1ARX/RF2) ; port BT RX
NetTP7_1: TP7.1 U1.14(PIO[5]/CTS) U2.3(PMD5/RE5) ; port BT CTS
NetTP8_1: TP8.1 U1.18(PIO[6]/RTS) U2.4(PMD6/RE6) ; port BT RTS
NetTP10_1: TP10.1 U1.7(WAKE_SW) U2.67(AETXEN/SDA1/INT4/RA15) ; port SWAKE
NetTP11_1: TP11.1 U1.8(CMD/MLDP) U2.66(AETXCLK/SCL1/INT3/RA14) ; port CMD/MLDP
NetTP12_1: TP12.1 U1.15(WAKE_HW) U2.99(PMD3/RE3) ; port BT WAKE
NetTP13_1: TP13.1 U1.22(SCL) U2.50(SCL3A/SDO3A/U3ATX/PMA8/CN18/RF5) ; port SCL
NetTP14_1: TP14.1 U1.21(SDA) U2.49(SDA3A/SDI3A/U3ARX/PMA9/CN17/RF4) ; port SDA
NetTP15_1: TP15.1 U2.5(PMD7/RE7) U3.8(DEN) ; port DEN
NetTP16_1: TP16.1 U2.18(AERXD0/INT1/RE8) U3.7(INT1) ; port INT1L3
NetTP17_1: TP17.1 U2.19(AERXD1/INT2/RE9) U3.6(DRDY/INT2) ; port INT2L3
NetU2_26: U2.26(PGEC2/AN6/OCFA/RB6) X1.5
NetU2_27: U2.27(PGED2/AN7/RB7) X1.4

Not connected (* = marked no-connect by the designer): U1 2(AIO2)* 3(AIO1)* 4(AIO0)* 13(PIO[4]/MISO)* 17(SPI/~{PIO})* 19(PIO[7]/PWM4)* 20(RSVD)*; U2 1(AERXERR/RG15)* 7(T3CK/AC2TX/RC2)* 8(T4CK/AC2RX/RC3)* 9(T5CK/SDI1/RC4)* 14(ERXCLK/~{SS2A}/U2BRX/~{U2ACTS}/PMA2/CN11/RG9)* 20(AN5/C1IN+/VBUSON/CN7/RB5)* 21(AN4/C1IN-/CN6/RB4)* 39(AC1TX/SCK3A/U3BTX/~{U3ARTS}/RF13)* 40(AC1RX/~{SS3A}/U3BRX/~{U3ACTS}/RF12)* 87(C1RX/ETXD1/PMD11/RF0)* 88(C1TX/ETXD0/PMD10/RF1)* 89(C2TX/ETXERR/PMD9/RG1)* 90(C2RX/PMD8/RG0)* 98(PMD2/RE2) 100(PMD4/RE4)*; X1 6*

### Notes on the sheet
- Gyroscope
- Connecter au GND
- Remplacé par le : IAM-20680
- Fichier :
- a
- Date :
- Heure :
- Version :
- Auteur :
- Modif.
- b
- c
- d
- Projet :
- No :
- Nb feuilles
- Feuille n°
- Chemin :
- (in symbol CMI-1295IC-0385T) +; -
- (in symbol Header 4 pin) Connecteur
- (in symbol Header 6 pins) Connecteur

### Library data of the parts
C1-C14 = CAP1206
D4 = SD0805S040S0R1: Diode Schottky 40V 100mA (DC) Surface Mount 0805 (2012 Metric); MF: AVX; DigiKey-Purchase-URL: https://snapeda.com/shop?store=DigiKey&id=809038; Arrow_Electronics-Purchase-URL: https://snapeda.com/shop?store=Arrow+Electronics&id=809038; Availability: Good; Price: None; Value: *; SnapEDA_Link: https://www.snapeda.com/parts/SD0805S040S0R1/AVX/view-part/809038/?ref=snap; MP: SD0805S040S0R1; Package: 0805 AVX; Mouser-Purchase-URL: https://snapeda.com/shop?store=Mouser&id=809038; Supplier 1: Mouser
LS1 = CMI-1295IC-0385T: 12 mm, 3 Vdc, 85 dB, Through Hole, Driving Circuit, Magnetic Audio Indicator Buzzer; MF: CUI Devices; Price: None; Value: *; Package: Package; Availability: Unavailable; SnapEDA_Link: https://www.snapeda.com/parts/CMI-1295IC-0385T/CUI%20Devices/view-part/4413411/?ref=snap; MP: CMI-1295IC-0385T; Supplier 1: Mouser
Q1 = NEMOS-GSD-3_D
R1-R10 = RES
S1-S3 = Switch SMD: Switch Surface Mount; MP: PTS526 SM08 SMTR2 LFS; MF: C&K; Price: None; Value: *; Package: None; SnapEDA_Link: https://www.snapeda.com/parts/PTS526%20SM08%20SMTR2%20LFS/C&K/view-part/4000306/?ref=snap; Availability: Unavailable
S4 = FSM4JH: Switch Push Button OFF _ON_ SPST Round Button 0.05A 24VDC Momentary Contact PC Pins Thru-Hole; Configuration_Pole-Throw: Single Pole - Single Throw; MF: TE Connectivity; Contact_Current_Rating: 50 mA; MP: 1825910-6; Digi-Key_Purchase_URL: https://www.digikey.com/product-detail/en/te-connectivity-alcoswitch-switches/1825910-6/450-1650-ND/1632536?utm_source=snapeda&utm_medium=aggregator&utm_campaign=symbol; TE_purchase_URL: https://www.te.com/usa-en/product-1825910-6.html?te_bu=Cor&te_type=disp&te_campaign=seda_glo_cor-seda-global-disp-prtnr-fy19-seda-model-bom-cta_sma-317_1&elqCampaignId=32493; Value: *; Digi-Key_Part_Number: 450-1650-ND; SnapEDA_Link: https://www.snapeda.com/parts/1825910-6/TE%20Connectivity%20ALCOSWITCH%20Switches/view-part/424522/?ref=snap; EU_RoHS_Compliance: Compliant; Package: None; Supplier 1: Mouser
TP1-TP9 TP18-TP20 = TESTPOINT: Test point smd; Supplier 1: Mouser
TP10-TP17 = TESTPOINT_via: Test point smd
X1 = Header 6 pins
X2 = Header 4 pin
D5 = USBLC6-2P6: Supplier 1: Mouser
U1 = MCHP-RN4020-MODULE-24: Supplier 1: Mouser
U2 = MC-32B-MX795-SQ100: Supplier 1: Mouser
U3 = STM-L3GD20H-LGA-16_A: Supplier 1: Farnell

## Nets that join several sheets
GND: 2008_SablierElectronique_Commande_Matrice (36 pins), 2008_SablierElectronique_SCH (42 pins)
VCC: 2008_SablierElectronique_Commande_Matrice (C17.2 C18.2 U5.24 U6.24), 2008_SablierElectronique_MosfetConnections (32 pins), 2008_SablierElectronique_SCH (29 pins)
BMatriceON: 2008_SablierElectronique_Commande_Matrice (U6.15), 2008_SablierElectronique_SCH (U2.29)
Config IN/OUT: 2008_SablierElectronique_Commande_Matrice (TP27.1 U5.1 U6.1), 2008_SablierElectronique_SCH (U2.94)
InBC1: 2008_SablierElectronique_MosfetConnections (Q50.1), 2008_SablierElectronique_SCH (U2.17)
InBC2: 2008_SablierElectronique_MosfetConnections (Q51.1), 2008_SablierElectronique_SCH (U2.38)
InBC3: 2008_SablierElectronique_MosfetConnections (Q52.1), 2008_SablierElectronique_SCH (U2.58)
InBC4: 2008_SablierElectronique_MosfetConnections (Q53.1), 2008_SablierElectronique_SCH (U2.59)
InBC5: 2008_SablierElectronique_MosfetConnections (Q54.1), 2008_SablierElectronique_SCH (U2.60)
InBC6: 2008_SablierElectronique_MosfetConnections (Q55.1), 2008_SablierElectronique_SCH (U2.61)
InBC7: 2008_SablierElectronique_MosfetConnections (Q56.1), 2008_SablierElectronique_SCH (U2.91)
InBC8: 2008_SablierElectronique_MosfetConnections (Q57.1), 2008_SablierElectronique_SCH (U2.92)
InBC9: 2008_SablierElectronique_MosfetConnections (Q58.1), 2008_SablierElectronique_SCH (U2.32)
InBC10: 2008_SablierElectronique_MosfetConnections (Q59.1), 2008_SablierElectronique_SCH (U2.33)
InBC11: 2008_SablierElectronique_MosfetConnections (Q60.1), 2008_SablierElectronique_SCH (U2.34)
InBC12: 2008_SablierElectronique_MosfetConnections (Q61.1), 2008_SablierElectronique_SCH (U2.35)
InBC13: 2008_SablierElectronique_MosfetConnections (Q62.1), 2008_SablierElectronique_SCH (U2.41)
InBC14: 2008_SablierElectronique_MosfetConnections (Q63.1), 2008_SablierElectronique_SCH (U2.42)
InBC15: 2008_SablierElectronique_MosfetConnections (Q64.1), 2008_SablierElectronique_SCH (U2.43)
InBC16: 2008_SablierElectronique_MosfetConnections (Q65.1), 2008_SablierElectronique_SCH (U2.44)
InC1: 2008_SablierElectronique_MosfetConnections (Q34.1), 2008_SablierElectronique_SCH (U2.72)
InC2: 2008_SablierElectronique_MosfetConnections (Q35.1), 2008_SablierElectronique_SCH (U2.76)
InC3: 2008_SablierElectronique_MosfetConnections (Q36.1), 2008_SablierElectronique_SCH (U2.77)
InC4: 2008_SablierElectronique_MosfetConnections (Q37.1), 2008_SablierElectronique_SCH (U2.78)
InC5: 2008_SablierElectronique_MosfetConnections (Q38.1), 2008_SablierElectronique_SCH (U2.81)
InC6: 2008_SablierElectronique_MosfetConnections (Q39.1), 2008_SablierElectronique_SCH (U2.82)
InC7: 2008_SablierElectronique_MosfetConnections (Q40.1), 2008_SablierElectronique_SCH (U2.83)
InC8: 2008_SablierElectronique_MosfetConnections (Q41.1), 2008_SablierElectronique_SCH (U2.84)
InC9: 2008_SablierElectronique_MosfetConnections (Q42.1), 2008_SablierElectronique_SCH (U2.68)
InC10: 2008_SablierElectronique_MosfetConnections (Q43.1), 2008_SablierElectronique_SCH (U2.69)
InC11: 2008_SablierElectronique_MosfetConnections (Q44.1), 2008_SablierElectronique_SCH (U2.70)
InC12: 2008_SablierElectronique_MosfetConnections (Q45.1), 2008_SablierElectronique_SCH (U2.71)
InC13: 2008_SablierElectronique_MosfetConnections (Q46.1), 2008_SablierElectronique_SCH (U2.79)
InC14: 2008_SablierElectronique_MosfetConnections (Q47.1), 2008_SablierElectronique_SCH (U2.80)
InC15: 2008_SablierElectronique_MosfetConnections (Q48.1), 2008_SablierElectronique_SCH (U2.47)
InC16: 2008_SablierElectronique_MosfetConnections (Q49.1), 2008_SablierElectronique_SCH (U2.48)
L1: 2008_SablierElectronique_Commande_Matrice (TP23.1 U5.10), 2008_SablierElectronique_SCH (U2.24)
L2: 2008_SablierElectronique_Commande_Matrice (TP24.1 U5.11), 2008_SablierElectronique_SCH (U2.25)
L3: 2008_SablierElectronique_Commande_Matrice (TP25.1 U5.14), 2008_SablierElectronique_SCH (U2.22)
L4: 2008_SablierElectronique_Commande_Matrice (TP26.1 U5.13), 2008_SablierElectronique_SCH (U2.23)
LB1: 2008_SablierElectronique_Commande_Matrice (TP31.1 U6.10), 2008_SablierElectronique_SCH (U2.63)
LB2: 2008_SablierElectronique_Commande_Matrice (TP30.1 U6.11), 2008_SablierElectronique_SCH (U2.64)
LB3: 2008_SablierElectronique_Commande_Matrice (TP29.1 U6.14), 2008_SablierElectronique_SCH (U2.73)
LB4: 2008_SablierElectronique_Commande_Matrice (TP28.1 U6.13), 2008_SablierElectronique_SCH (U2.74)
MatriceON: 2008_SablierElectronique_Commande_Matrice (U5.15), 2008_SablierElectronique_SCH (U2.28)